# Altium schematic sheet MCU_Board.SchDoc
size A4; SheetNumber: 1; SheetTotal: 1
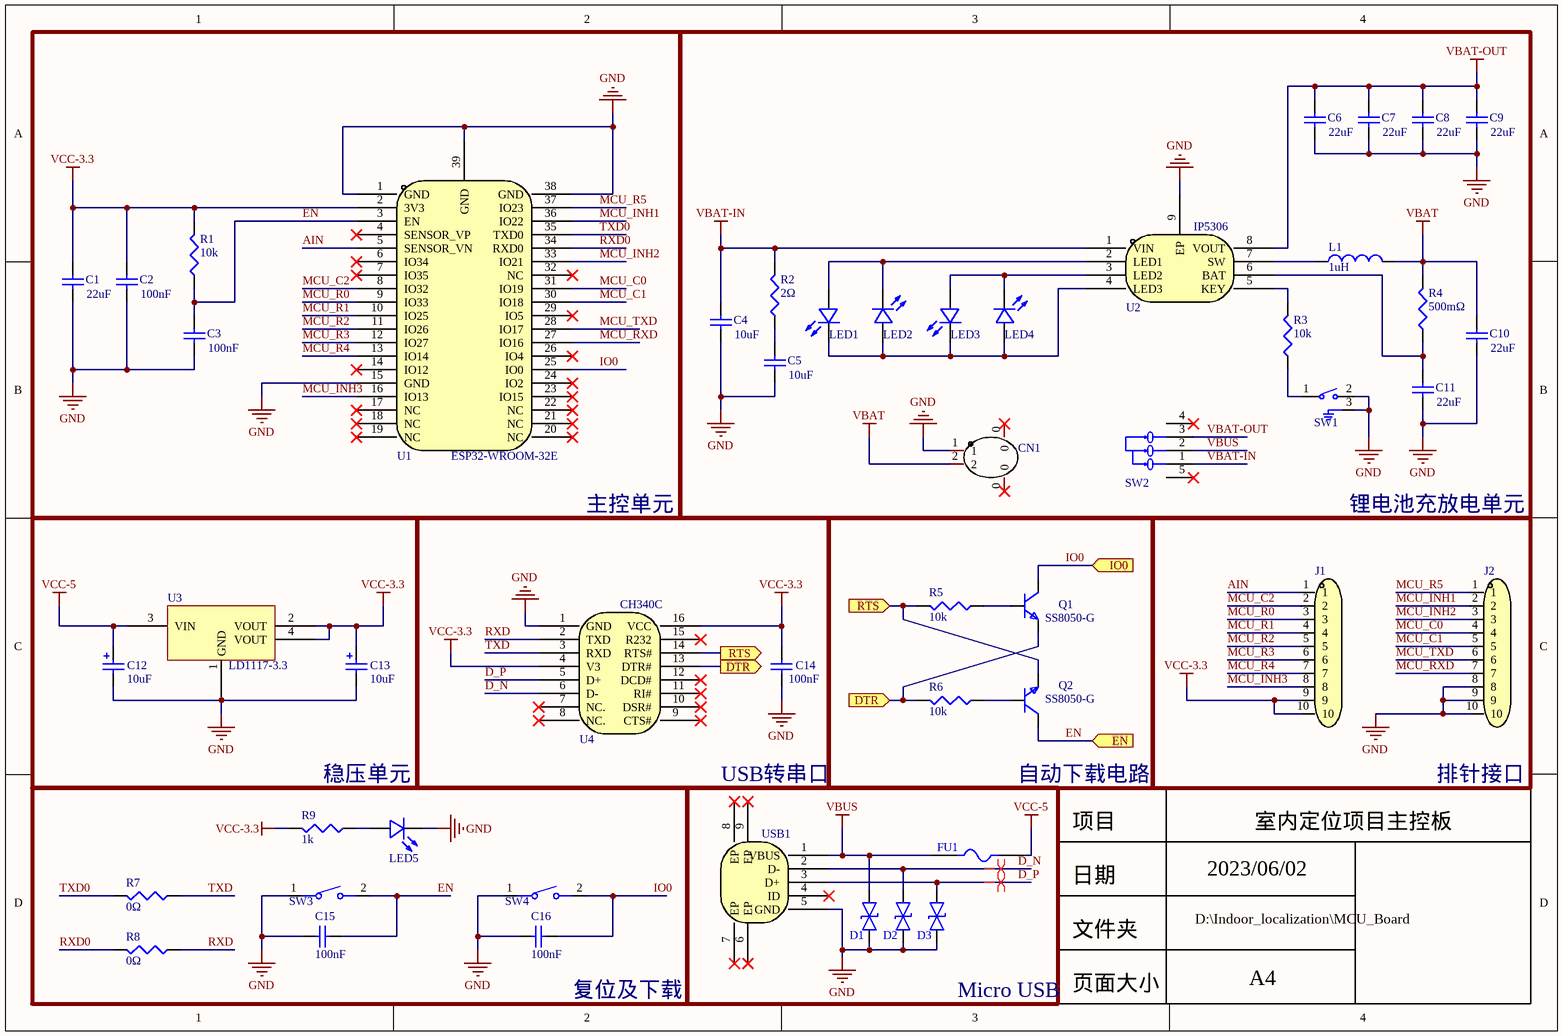
[diagram p0: MCU_Board.SchDoc]

## Parts
C1  value 22uF  [C0603]  (hidden comment: Cap)
C2  value 100nF  [C0603]  (hidden comment: Cap)
C3  value 100nF  [C0603]  (hidden comment: Cap)
C4  value 10uF  [C0603]  (hidden comment: Cap)
C5  value 10uF  [C0603]  (hidden comment: Cap)
C6  value 22uF  [C1206]  (hidden comment: Cap)
C7  value 22uF  [C1206]  (hidden comment: Cap)
C8  value 22uF  [C1206]  (hidden comment: Cap)
C9  value 22uF  [C1206]  (hidden comment: Cap)
C10  value 22uF  [C1206]  (hidden comment: Cap)
C11  value 22uF  [C1206]  (hidden comment: Cap)
C12  value 10uF  [CAP-SMD_L3.2-W1.6-RD-C7171]  (hidden comment: TAJA106K016RNJ)
C13  value 10uF  [CAP-SMD_L3.2-W1.6-RD-C7171]  (hidden comment: TAJA106K016RNJ)
C14  value 100nF  [C0603]  (hidden comment: Cap)
C15  value 100nF  [C0603]  (hidden comment: Cap)
C16  value 100nF  [C0603]  (hidden comment: Cap)
CN1  1.0T-2P卧贴  [CONN-SMD_1.0T-2P]  (value not drawn)
D1  LESD5D5.0CT1G  [SOD-523_L1.2-W0.8-LS1.6-BI]  (value not drawn)
D2  LESD5D5.0CT1G  [SOD-523_L1.2-W0.8-LS1.6-BI]  (value not drawn)
D3  LESD5D5.0CT1G  [SOD-523_L1.2-W0.8-LS1.6-BI]  (value not drawn)
FU1  FUSE 1A  [F0805]  (value not drawn)
J1  Header 10X1  [HDR-TH_10P-P2.54-V-M]  (value not drawn)
J2  Header 10X1  [HDR-TH_10P-P2.54-V-M]  (value not drawn)
L1  value 1uH  [IND-SMD_L6.5-W6.5_IHLP-2525]  (hidden comment: Inductor)
LED1  NCD0603G2  [LED0603-RD]  (value not drawn)
LED2  NCD0603G2  [LED0603-RD]  (value not drawn)
LED3  NCD0603G2  [LED0603-RD]  (value not drawn)
LED4  NCD0603G2  [LED0603-RD]  (value not drawn)
LED5  NCD0603G2  [LED0603-RD]  (value not drawn)
Q1  SS8050-G  [SOT-23-3_L2.9-W1.3-P1.90-LS2.4-BR]
Q2  SS8050-G  [SOT-23-3_L2.9-W1.3-P1.90-LS2.4-BR]
R1  10k  [R0603]
R2  2Ω  [R0603]
R3  10k  [R0603]
R4  500mΩ  [R0603]
R5  10k  [R0603]
R6  10k  [R0603]
R7  0Ω  [R0603]
R8  0Ω  [R0603]
R9  1k  [R0603]
SW1  GT-TCB73B-H048-L1  [SW-TH_G-SWITCH_GT-TCB73B-H048-L1]  (value not drawn)
SW2  SK12D07VG3  [SW-TH_SK12D07VG3]  (value not drawn)
SW3  TS-1088-AR02016  [SW-SMD_L3.9-W3.0-P4.45]  (value not drawn)
SW4  TS-1088-AR02016  [SW-SMD_L3.9-W3.0-P4.45]  (value not drawn)
U1  ESP32-WROOM-32E  [WIFI-SMD_ESP32-WROOM-32E]
U2  IP5306  [ESOP-8_L4.9-W3.9-P1.27-LS6.0-BL-EP]
U3  LD1117-3.3  [SOT-223-3_L6.5-W3.4-P2.30-LS7.0-BR]
U4  CH340C  [SOP-16_L10.0-W3.9-P1.27-LS6.0-BL]
USB1  U-F-M5DD-W-2  [MICRO-USB-SMD_MICRO-USB-A17]  (value not drawn)

## Blocks framed on the sheet
主控单元: C1-C3 R1 U1
锂电池充放电单元: C4-C11 CN1 L1 LED1-LED4 R2-R4 SW1 SW2 U2
稳压单元: C12 C13 U3
自动下载电路: Q1 Q2 R5 R6
复位及下载: C15 C16 LED5 R7-R9 SW3 SW4

## Ports
DTR (in, see MCU_Board[2C]), DTR (out, see MCU_Board[3C]), EN (in), IO0 (in), RTS (in, see MCU_Board[2C]), RTS (out, see MCU_Board[3C])

## Nets
GND: C1.1 C2.1 C3.1 C4.1 C5.1 C6.1 C7.1 C8.1 C9.1 C10.1 C11.1 C12.2 C13.2 C14.2 C15.2 C16.2 CN1.1 D1.1 D2.1 D3.1 J2.8 J2.9 J2.10 LED5.1(K) SW1.2 SW1.3 SW3.1 SW4.1 U1.1(GND) U1.15(GND) U1.38(GND) U1.39(GND) U2.9(EP) U3.1(GND) U4.1(GND) USB1.5(GND)
VBAT: C10.2 CN1.2 L1.2 R4.2
VBAT-IN: C4.2 R2.2 SW2.1 U2.1(VIN)
VBAT-OUT: C6.2 C7.2 C8.2 C9.2 SW2.3 U2.8(VOUT)
VBUS: D1.2 FU1.1 SW2.2 USB1.1(VBUS)
VCC-3.3: C1.2 C2.2 C13.1 C14.1 J1.9 J1.10 R1.2 R9.2 U1.2(3V3) U3.2(VOUT) U3.4(VOUT) U4.4(V3) U4.16(VCC)
VCC-5: C12.1 FU1.2 U3.3(VIN)
AIN: J1.1 U1.5(SENSOR_VN)
D_N: D2.2 U4.6(D-) USB1.2(D-)
D_P: D3.2 U4.5(D+) USB1.3(D+)
DTR: Q1.2(E) R6.2 U4.13(DTR#) ; port DTR
EN: C3.2 C15.1 Q2.3(C) R1.1 SW3.2 U1.3(EN) ; port EN
IO0: C16.1 Q1.3(C) SW4.2 U1.25(IO0) ; port IO0
MCU_C0: J2.4 U1.31(IO19)
MCU_C1: J2.5 U1.30(IO18)
MCU_C2: J1.2 U1.8(IO32)
MCU_INH1: J2.2 U1.36(IO22)
MCU_INH2: J2.3 U1.33(IO21)
MCU_INH3: J1.8 U1.16(IO13)
MCU_R0: J1.3 U1.9(IO33)
MCU_R1: J1.4 U1.10(IO25)
MCU_R2: J1.5 U1.11(IO26)
MCU_R3: J1.6 U1.12(IO27)
MCU_R4: J1.7 U1.13(IO14)
MCU_R5: J2.1 U1.37(IO23)
MCU_RXD: J2.7 U1.27(IO16)
MCU_TXD: J2.6 U1.28(IO17)
RTS: Q2.2(E) R5.2 U4.14(RTS#) ; port RTS
RXD: R8.1 U4.2(TXD)
RXD0: R8.2 U1.34(RXD0)
TXD: R7.1 U4.3(RXD)
TXD0: R7.2 U1.35(TXD0)
NetC5_2: C5.2 R2.1
NetC11_2: C11.2 R4.1 U2.6(BAT)
NetL1_1: L1.1 U2.7(SW)
NetLED1_1: LED1.1(K) LED2.2(A) LED3.1(K) LED4.2(A) U2.4(LED3)
NetLED1_2: LED1.2(A) LED2.1(K) U2.2(LED1)
NetLED3_2: LED3.2(A) LED4.1(K) U2.3(LED2)
NetLED5_2: LED5.2(A) R9.1
NetQ1_1: Q1.1(B) R5.1
NetQ2_1: Q2.1(B) R6.1
NetR3_1: R3.1 SW1.1
NetR3_2: R3.2 U2.5(KEY)

Not connected (* = marked no-connect by the designer): CN1 0*; SW2 4* 5*; U1 4(SENSOR_VP)* 6(IO34)* 7(IO35)* 14(IO12)* 17(NC)* 18(NC)* 19(NC)* 20(NC)* 21(NC)* 22(NC)* 23(IO15)* 24(IO2)* 26(IO4)* 29(IO5)* 32(NC)*; U4 7(NC.)* 8(NC.)* 9(CTS#)* 10(DSR#)* 11(RI#)* 12(DCD#)* 15(R232)*; USB1 4(ID)* 6(EP)* 7(EP)* 8(EP)* 9(EP)*

## Layout directives
differential pair: D_N, D_P

## Notes on the sheet
- USB转串口
- (near J2) 排针接口
- 项目
- 室内定位项目主控板
- 日期
- 2023/06/02
- 文件夹
- D:\Indoor_localization\MCU_Board
- A4
- Micro USB
- 页面大小

## Library data of the parts
C1-C11 C14-C16 = Cap: Capacitor; Published: 8-Jun-2000; LatestRevisionDate: 17-Jul-2002; LatestRevisionNote: Re-released for DXP Platform.; PackageReference: RAD-0.3; Publisher: Altium Limited; PackageDescription: Radial Cap, Thru-Hole; 2 Leads; 0.3 in Pin Spacing
C12 C13 = Cap-TAJA: 贴片钽电容; Manufacturer: Kyocera AVX; Add into BOM: yes; Tolerance: ±10%; Rated Voltage: 16V; Equivalent Series Resistance(ESR): 3Ω@100kHz; Name: 10uF; Symbol: TAJA106K016RNJ; Device: TAJA106K016RNJ; LCSC Part Name: 10uF ±10% 16V; Supplier Part: C7171; Manufacturer Part: TAJA106K016RNJ; Supplier Footprint: CASE-A-3216; JLCPCB Part Class: Basic Part; Datasheet: https://atta.szlcsc.com/upload/public/pdf/source/20160107/1457707748093.pdf; Supplier: LCSC; Convert to PCB: yes; Operating Temperature: -55℃~+125℃
CN1 = 1.0T-2P卧贴: 锂电池接口; Manufacturer: BOOMELE(博穆精密); Symbol: 1.0T-2P_C145954; Add into BOM: yes; Reference Series: SH; Pitch: 1mm; Pins Structure: 1x2P; Number of PINs Per Row: 2; Name: 1.0T-2P卧贴; Device: 1.0T-2P卧贴; LCSC Part Name: SH 1mm 1x2P 卧贴; Supplier Part: C145954; Manufacturer Part: 1.0T-2P卧贴; Supplier Footprint: SMD,P=1mm; JLCPCB Part Class: Extended Part; Datasheet: https://atta.szlcsc.com/upload/public/pdf/source/20171115/C145954_15107293403501120439.pdf; Supplier: LCSC; Convert to PCB: yes; Number of Rows: 1; Row Spacing: -; Mounting Style: -; Contact Material: 磷铜
D1-D3 = LESD5D5.0CT1G: 静电放电(ESD)保护器件; Designer: U?; Symbol: LESD5D5.0CT1G; Device: LESD5D5.0CT1G
FU1 = FU: 贴片保险丝; Manufacturer: RUILON(瑞隆源); Name: SMD0805P075TF; Device: SMD0805P075TF_C20979; Add into BOM: yes; Operating Voltage (Max): 6V; Current Rating (Max): 40A; Hold Current: 750mA; Trip Current: 1.5A; Symbol: SMD0805P075TF; LCSC Part Name: 6V 750mA 0805自恢复; Supplier Part: C20979; Manufacturer Part: SMD0805P075TF; Supplier Footprint: 0805; JLCPCB Part Class: Extended Part; Datasheet: https://atta.szlcsc.com/upload/public/pdf/source/20140222/1457706788789.pdf; Supplier: LCSC; Convert to PCB: yes
J1 J2 = Header 10X1: 10P*1接插件; Symbol: MF254V-11-10-1000-H70; Designer: U?; Device: MF254V-11-10-1000-H70
L1 = Inductor: Code_IEC: 1005; Published: 8-Jun-2000; LatestRevisionDate: 29-May-2009; LatestRevisionNote: IPC-7351 Footprint Added.; PackageReference: 0402-A; Publisher: Altium Limited; PackageDescription: Chip Inductor; Code_JEITA: 0402
LED1-LED4 = NCD0603G2: Manufacturer: 国星光电; Symbol: FC-1608UGK-520D; Add into BOM: yes; Emitted Color: 翠绿; Name: NCD0603G2; Device: NCD0603G2; LCSC Part Name: 翠绿; Supplier Part: C87326; Manufacturer Part: NCD0603G2; Supplier Footprint: 0603; JLCPCB Part Class: Extended Part; Datasheet: https://atta.szlcsc.com/upload/public/pdf/source/20200820/C87326_434E337B13CFAB9A1423E0838CFDDDAC.pdf; Supplier: LCSC; Convert to PCB: yes
LED5 = NCD0603G2: LED; Manufacturer: 国星光电; Symbol: FC-1608UGK-520D; Add into BOM: yes; Emitted Color: 翠绿; Name: NCD0603G2; Device: NCD0603G2; LCSC Part Name: 翠绿; Supplier Part: C87326; Manufacturer Part: NCD0603G2; Supplier Footprint: 0603; JLCPCB Part Class: Extended Part; Datasheet: https://atta.szlcsc.com/upload/public/pdf/source/20200820/C87326_434E337B13CFAB9A1423E0838CFDDDAC.pdf; Supplier: LCSC; Convert to PCB: yes
Q1 Q2 = SS8050-G: Manufacturer: CJ(江苏长电/长晶); Symbol: SS8050-G_C164885; Add into BOM: yes; Transistor Type: NPN; Collector-Emitter Breakdown Voltage (Vceo): 25V; Collector Current (Ic): 1.5A; Power Dissipation (Pd): 300mW; Collector Cut-Off Current (Icbo): 100nA; Collector-Emitter Saturation Voltage (VCE(sat)@Ic,Ib): 500mV@800mA,80mA; DC Current Gain (hFE@Ic,Vce): 200@100mA,1V; Transition Frequency (fT): 100MHz; Name: SS8050-G; Device: SS8050-G; LCSC Part Name: NPN 25V 1.5A H档(200-350); Supplier Part: C164885; Manufacturer Part: SS8050-G; Supplier Footprint: SOT-23; JLCPCB Part Class: Extended Part; Datasheet: https://atta.szlcsc.com/upload/public/pdf/source/20171228/C164885_15144412871481213889.pdf; Supplier: LCSC; Convert to PCB: yes; Operating Temperature: +150℃@(Tj)
R1-R9 = Res3: Resistor; Published: 8-Jun-2000; LatestRevisionDate: 29-May-2009; LatestRevisionNote: IPC-7351 Footprint Added.; PackageReference: J1-0603; Publisher: Altium Limited; PackageDescription: Chip Resistor
SW1 = GT-TCB73B-H048-L1: Manufacturer: G-Switch(品赞); Add into BOM: yes; Contact Current: 50mA; Voltage Rating (DC): 12V; Insulation Resistance: 100MΩ; Circuit: 单刀单掷; Actuator Style: 圆形按钮; Actuator/Cap Color: 黑色; With Lamp: 无; Operating Force: 250gf@±30gf; Mechanical Life: 10万次; Pin Style: PC引脚; Switch Length: 4.5mm; Switch Height: 4.8mm; Strike Gundam: 否; Name: GT-TCB73B-H048-L1; Symbol: GT-TCB73B-H048-L1; Device: GT-TCB73B-H048-L1; LCSC Part Name: 4.5*4.5*4.8mm 卧插 轻触开关; Supplier Part: C2890354; Manufacturer Part: GT-TCB73B-H048-L1; Supplier Footprint: 插件; JLCPCB Part Class: Extended Part; Datasheet: https://atta.szlcsc.com/upload/public/pdf/source/20211129/A9DBC36F7854845B7C58D6A3B2089FE3.pdf; Supplier: LCSC; Convert to PCB: yes; Mounting Style: 卧插; Operating Temperature: -30℃~+85℃; Switch Width: 4.5mm
SW2 = SK12D07VG3: Manufacturer: SHOU HAN(首韩); Symbol: SK12D07VG3_C431547; Add into BOM: yes; Name: SK12D07VG3; Device: SK12D07VG3; LCSC Part Name: 两档位卧式拨动开关,柄长3MM; Supplier Part: C431547; Manufacturer Part: SK12D07VG3; Supplier Footprint: 插件; JLCPCB Part Class: Extended Part; Datasheet: https://atta.szlcsc.com/upload/public/pdf/source/20190925/C431547_01B93C6F3FA5C09E15F8CCBF4E6DB91A.pdf; Supplier: LCSC; Convert to PCB: yes
SW3 SW4 = TS-1088-AR02016: Manufacturer: XUNPU(讯普); Add into BOM: yes; Contact Current: 50mA; Voltage Rating (DC): 12V; Insulation Resistance: 100MΩ; Circuit: 单刀单掷; Actuator Style: 圆形按钮; Actuator/Cap Color: 黑色; Operating Force: 160gf@±50gf; Mechanical Life: 10万次; Pin Style: SMD接片; Switch Length: 4mm; Switch Width: 3mm; Switch Height: 2mm; Strike Gundam: 否; Name: TS-1088-AR02016; Symbol: TS-1088-AR02016; Device: TS-1088-AR02016; LCSC Part Name: 4*3*2mm 立贴 轻触开关; Supplier Part: C720477; Manufacturer Part: TS-1088-AR02016; Supplier Footprint: SMD; JLCPCB Part Class: Extended Part; Datasheet: https://atta.szlcsc.com/upload/public/pdf/source/20200810/C720475_60D09DD6C54279ADDB2DC25100F1CC11.pdf; Supplier: LCSC; Convert to PCB: yes; Mounting Style: 立贴; Operating Temperature: -30℃~+80℃
U1 = ESP32-WROOM-32E-N16_C701343: Manufacturer: ESPRESSIF(乐鑫); Symbol: ESP32-WROOM-32E(16MB); Add into BOM: yes; Name: ESP32-WROOM-32E-N16; Device: ESP32-WROOM-32E-N16_C701343; LCSC Part Name: 通用型Wi-Fi+BT+BLEMCU模组 PCB板载天线模组; Supplier Part: C701343; Manufacturer Part: ESP32-WROOM-32E-N16; Supplier Footprint: SMD,18x25.5mm; JLCPCB Part Class: Extended Part; Datasheet: https://atta.szlcsc.com/upload/public/pdf/source/20200730/C701341_95E089979D39CD8D2471FDC7C7AF29A1.pdf; Supplier: LCSC; Convert to PCB: yes
U2 = IP5306: Manufacturer: INJOINIC(英集芯); Add into BOM: yes; Name: IP5306; Symbol: IP5306; Device: IP5306; LCSC Part Name: IP5306; Supplier Part: C181692; Manufacturer Part: IP5306; Supplier Footprint: ESOP-8; JLCPCB Part Class: Extended Part; Datasheet: https://atta.szlcsc.com/upload/public/pdf/source/20180920/C181692_842C9BF636DF123BB66E91FC1AD6F13F.pdf; Supplier: LCSC; Convert to PCB: yes
U3 = LD1117-3.3: 低压差线性稳压器3.3V
U4 = CH340C: Manufacturer: WCH(南京沁恒); Add into BOM: yes; Applications Function: Transceiver; Protocol: USB 2.0; Data Rate: 2Mbps; Supply Voltage: 3.3V；5V; Name: CH340C; Symbol: CH340C; Device: CH340C; LCSC Part Name: CH340C; Supplier Part: C84681; Manufacturer Part: CH340C; Supplier Footprint: SOP-16; JLCPCB Part Class: Extended Part; Datasheet: https://atta.szlcsc.com/upload/public/pdf/source/20200819/C84681_ADBED554CE321879DBD6B1D06488689C.pdf; Supplier: LCSC; Convert to PCB: yes
USB1 = U-F-M5DD-W-2: Manufacturer: 韩国韩荣; Add into BOM: yes; Connector Type: Micro-B; Gender: 母座; Number of Contacts: 5; Number of Ports: 1; Name: U-F-M5DD-W-2; Symbol: U-F-M5DD-W-2; Device: U-F-M5DD-W-2; LCSC Part Name: U-F-M5DD-W-2; Supplier Part: C145793; Manufacturer Part: U-F-M5DD-W-2; Supplier Footprint: -; JLCPCB Part Class: Extended Part; Datasheet: https://atta.szlcsc.com/upload/public/pdf/source/20200930/C879723_6542CD70930DA81B6877F7A914B29468.pdf; Supplier: LCSC; Convert to PCB: yes; Standard: USB 2